# Altium schematic sheet USB-RS485.SchDoc: Название платы
size 420 x 297 mm; ApprovedBy: Рогов; CheckedBy: Фамилия проверяющего; DrawnBy: Нечаева А.Н.; DocumentNumber: Введите номер платы + Э3; SheetNumber: пусто если лист 1, иначе 1; SheetTotal: количество листов; Title1str: (при необходимости вторая строка); DocumentType: тип схемы; Format: A3; ImagePath: Введите номер платы
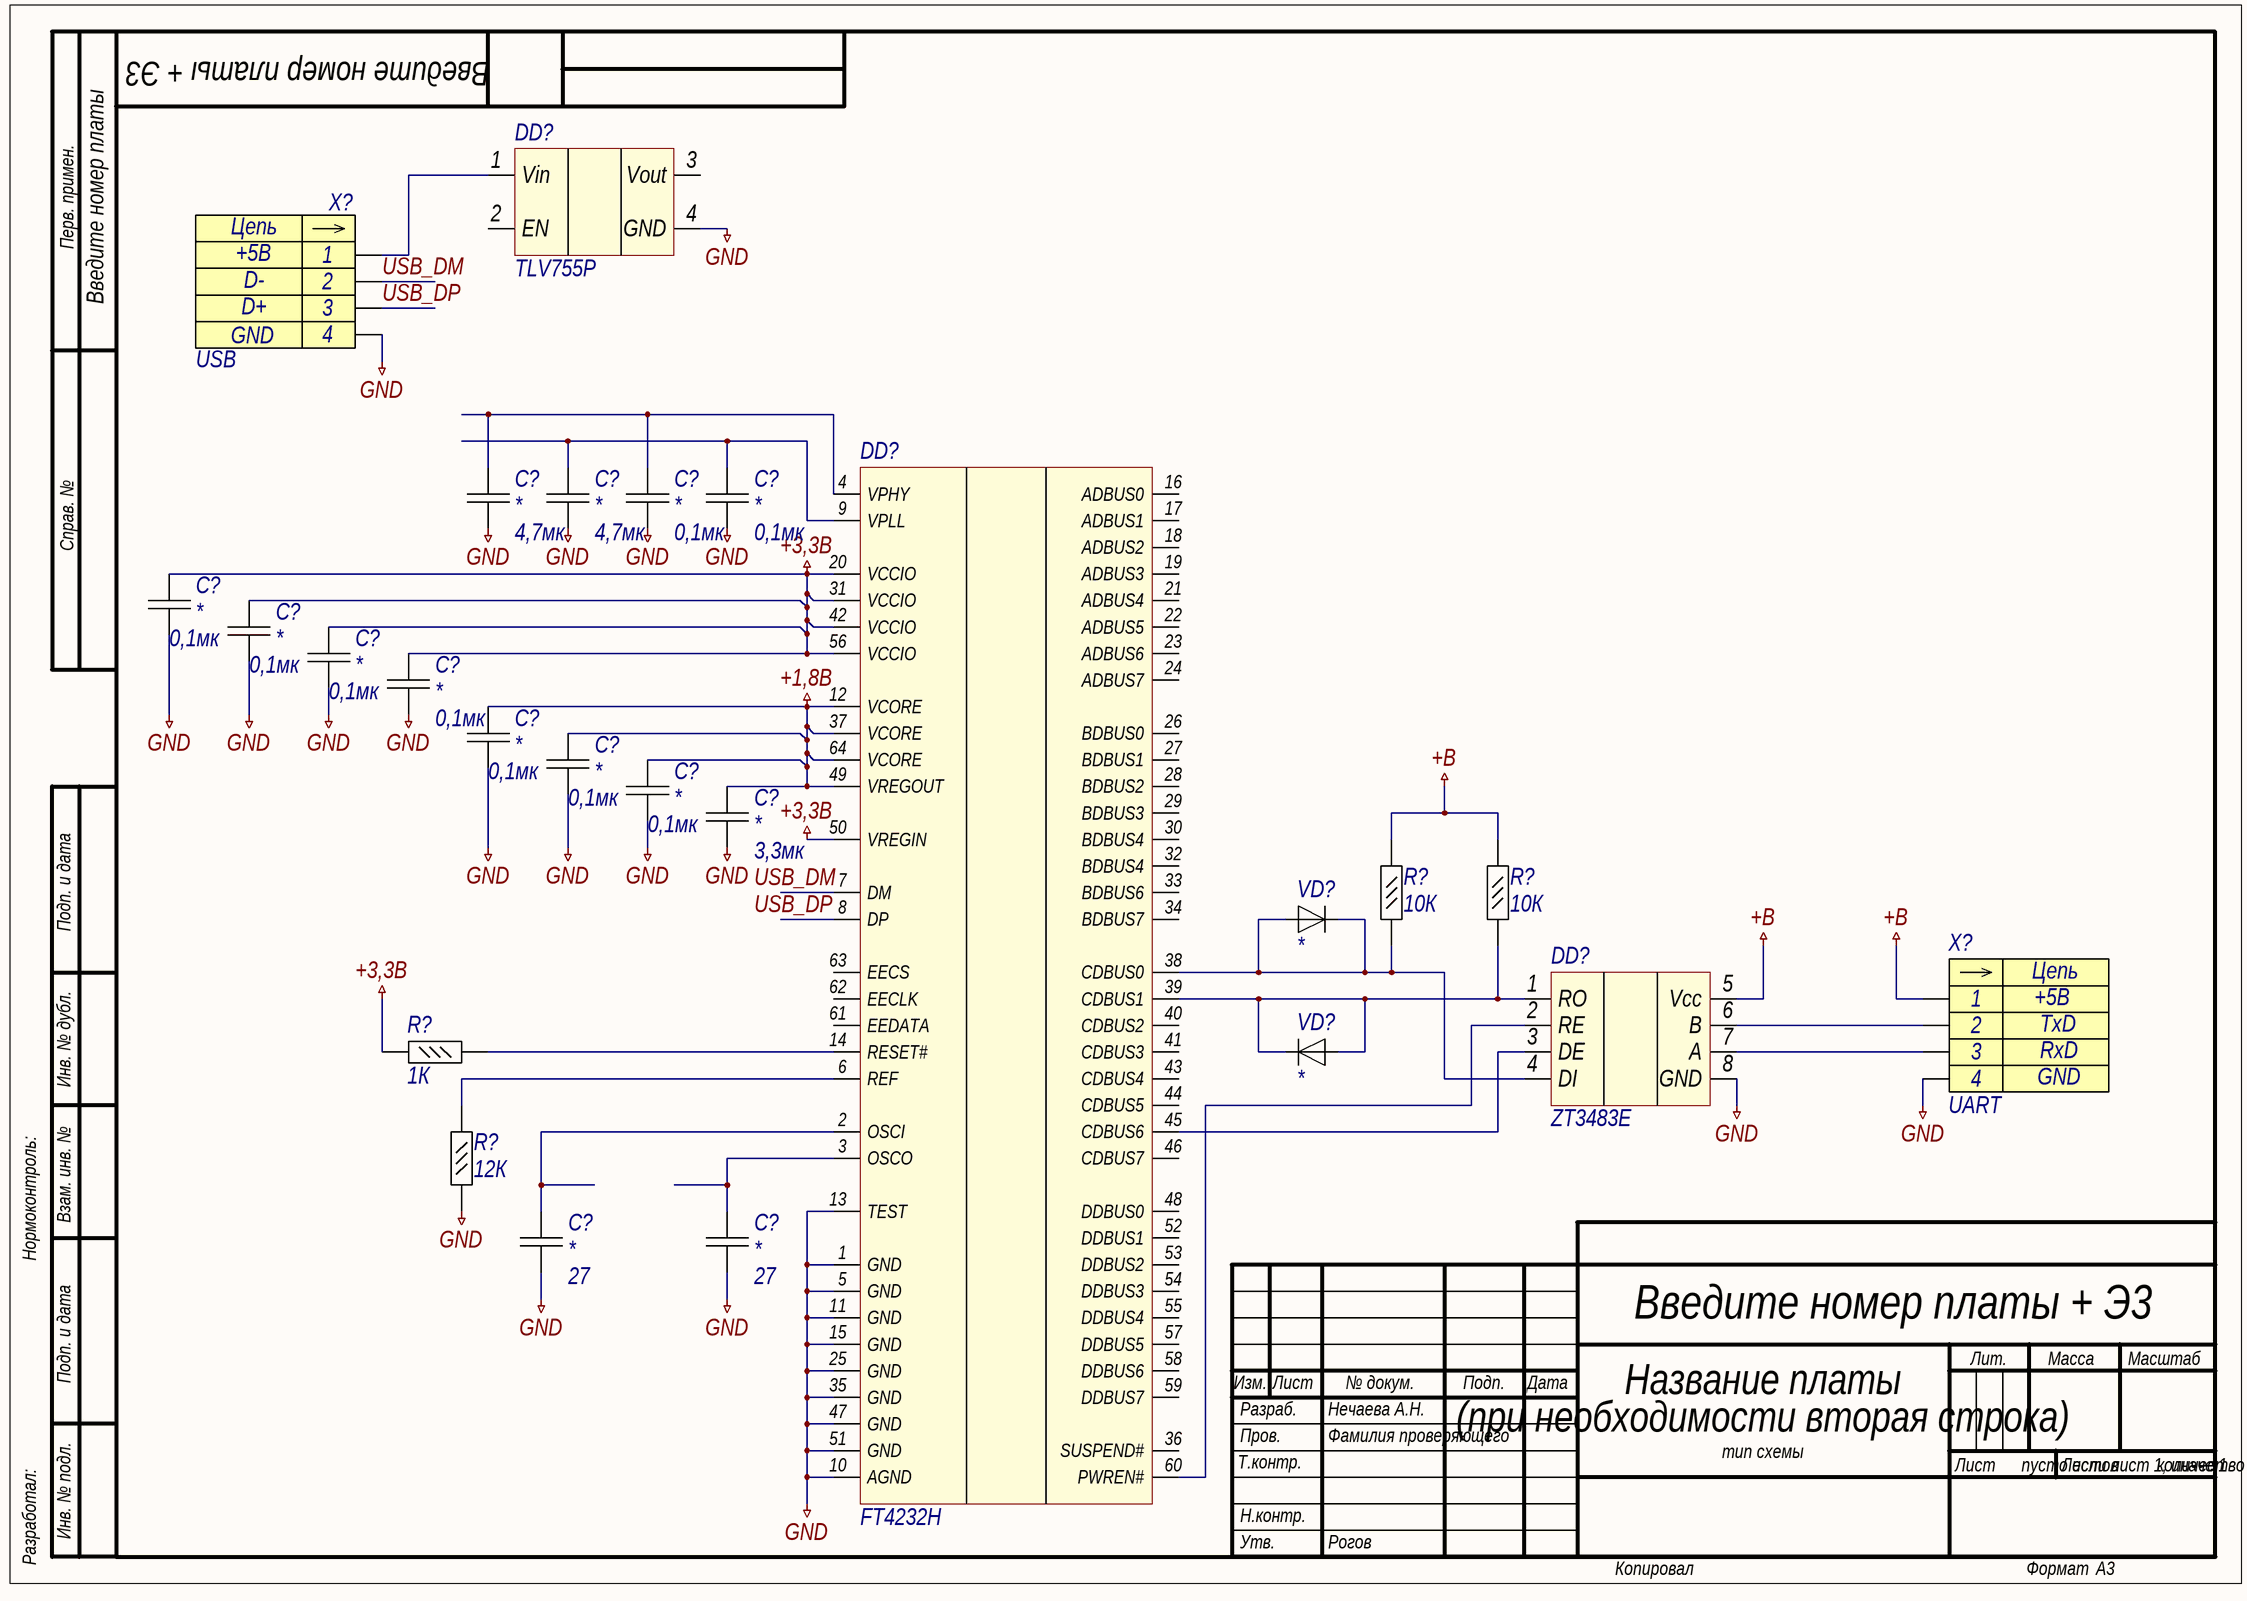
[diagram p0: USB-RS485.SchDoc]

## Parts
(Parts that share a designator on the sheet are numbered #1, #2 ... from top to bottom, then left to right.)
C?#1  Capacitance: 4,7мк  (hidden comment: Capacitor)
C?#2  Capacitance: 4,7мк  (hidden comment: Capacitor)
C?#3  Capacitance: 0,1мк  (hidden comment: Capacitor)
C?#4  Capacitance: 0,1мк  (hidden comment: Capacitor)
C?#5  Capacitance: 0,1мк  (hidden comment: Capacitor)
C?#6  Capacitance: 0,1мк  (hidden comment: Capacitor)
C?#7  Capacitance: 0,1мк  (hidden comment: Capacitor)
C?#8  Capacitance: 0,1мк  (hidden comment: Capacitor)
C?#9  Capacitance: 0,1мк  (hidden comment: Capacitor)
C?#10  Capacitance: 0,1мк  (hidden comment: Capacitor)
C?#11  Capacitance: 0,1мк  (hidden comment: Capacitor)
C?#12  Capacitance: 3,3мк  (hidden comment: Capacitor)
C?#13  Capacitance: 27  (hidden comment: Capacitor)
C?#14  Capacitance: 27  (hidden comment: Capacitor)
DD?#1  TLV755P
DD?#2  FT4232H
DD?#3  ZT3483E
R?#1  Impedance: 10К  (hidden comment: Res_0.05)
R?#2  Impedance: 10К  (hidden comment: Res_0.05)
R?#3  Impedance: 1К  (hidden comment: Res_0.05)
R?#4  Impedance: 12К  (hidden comment: Res_0.05)
VD?#1  *  [SOD123]
VD?#2  *  [SOD123]
X?#1  USB  U: +5В  Out: D-  In: D+  [USB]
X?#2  UART  In: TxD  Out: RxD  U: +5В  [UART]

## Nets
+1,8В: C?#9.11(C1+) C?#10.11(C1+) C?#11.11(C1+) C?#12.11(C1+) DD?#2.12(VCORE) DD?#2.37(VCORE) DD?#2.49(VREGOUT) DD?#2.64(VCORE)
+3,3В: C?#5.11(C1+) C?#6.11(C1+) C?#7.11(C1+) C?#8.11(C1+) DD?#2.20(VCCIO) DD?#2.31(VCCIO) DD?#2.42(VCCIO) DD?#2.50(VREGIN) DD?#2.56(VCCIO) R?#3.10(C1-)
+В: DD?#3.5(Vcc) R?#1.10(C1-) R?#2.10(C1-) X?#2.1
GND: C?#1.11(C1-) C?#2.11(C1-) C?#3.11(C1-) C?#4.11(C1-) C?#5.11(C1-) C?#6.11(C1-) C?#7.11(C1-) C?#8.11(C1-) C?#9.11(C1-) C?#10.11(C1-) C?#11.11(C1-) C?#12.11(C1-) C?#13.11(C1-) C?#14.11(C1-) DD?#1.4(GND) DD?#2.1(GND) DD?#2.5(GND) DD?#2.10(AGND) DD?#2.11(GND) DD?#2.13(TEST) DD?#2.15(GND) DD?#2.25(GND) DD?#2.35(GND) DD?#2.47(GND) DD?#2.51(GND) DD?#3.8(GND) R?#4.9(C1-) X?#1.4 X?#2.4
USB_DM: X?#1.2
USB_DP: X?#1.3
NetC?#1_11: C?#1.11(C1+) C?#3.11(C1+) DD?#2.4(VPHY)
NetC?#2_11: C?#2.11(C1+) C?#4.11(C1+) DD?#2.9(VPLL)
NetC?#13_11: C?#13.11(C1+) DD?#2.2(OSCI)
NetC?#14_11: C?#14.11(C1+) DD?#2.3(OSCO)
NetDD?#1_1: DD?#1.1(Vin) X?#1.1
NetDD?#2_6: DD?#2.6(REF) R?#4.10(C1-)
NetDD?#2_14: DD?#2.14(RESET#) R?#3.9(C1-)
NetDD?#2_38: DD?#2.38(CDBUS0) DD?#3.4(DI) R?#1.9(C1-) VD?#1.1 VD?#1.2
NetDD?#2_39: DD?#2.39(CDBUS1) DD?#3.1(RO) R?#2.9(C1-) VD?#2.1 VD?#2.2
NetDD?#2_45: DD?#2.45(CDBUS6) DD?#3.3(DE)
NetDD?#2_60: DD?#2.60(PWREN#) DD?#3.2(RE)
NetDD?#3_6: DD?#3.6(B) X?#2.2
NetDD?#3_7: DD?#3.7(A) X?#2.3

Not connected (* = marked no-connect by the designer): DD?#1 2(EN) 3(Vout); DD?#2 7(DM) 8(DP) 16(ADBUS0) 17(ADBUS1) 18(ADBUS2) 19(ADBUS3) 21(ADBUS4) 22(ADBUS5) 23(ADBUS6) 24(ADBUS7) 26(BDBUS0) 27(BDBUS1) 28(BDBUS2) 29(BDBUS3) 30(BDBUS4) 32(BDBUS4) 33(BDBUS6) 34(BDBUS7) 36(SUSPEND#) 40(CDBUS2) 41(CDBUS3) 43(CDBUS4) 44(CDBUS5) 46(CDBUS7) 48(DDBUS0) 52(DDBUS1) 53(DDBUS2) 54(DDBUS3) 55(DDBUS4) 57(DDBUS5) 58(DDBUS6) 59(DDBUS7) 61(EEDATA) 62(EECLK) 63(EECS)

## Notes on the sheet
- Перв. примен.
- Справ. №
- Подп. и дата
- Инв. № дубл.
- Нормоконтроль:
- Взам. инв. №
- Изм.
- Лист
- № докум.
- Подп.
- Дата
- Лит.
- Масса
- Масштаб
- Т.контр.
- Пров.
- Разраб.
- Листов
- Разработал:
- Инв. № подл.
- Н.контр.
- Утв.
- Копировал
- Формат
- Labels drawn without touching a wire or pin: USB_DM, USB_DP
- (in symbol UART) Цепь
- (in symbol USB) Цепь

## Library data of the parts
DD?#1 = LDO +3.3V: Case: *; HelpUrL: https://ru.mouser.com/ProductDetail/Texas-Instruments/TLV75533PDBVR?qs=sGAEpiMZZMsGz1a6aV8DcD1rpA6FsR3JKgt9d%252bpuSX4%3d; Model: TLV755P
DD?#2 = DS_FT4232H: Manufactere: FTDI, Future Technology Devices International Ltd; HelpURL: https://www.ftdichip.com/Products/ICs/FT4232H.htm; Case: QFN-64; Model: FT4232H
VD?#1 VD?#2 = Diod: ComponentKind: *; Manufacturer: *; Model: *; HelpURL: *
X?#1 = USB: Create: DeathSpeaker; GND: GND
X?#2 = UART: Create: DeathSpeaker; GND: GND
C?#1-C?#14 = Capacitor: Manufacture: *; Case: *; HelpURL: *; Model: *; Voltage: *
DD?#3 = ZT3483E: Case: nSOIC-8; Model: ZT3483E; Manufacture: *; HelpURL: *
R?#1-R?#4 = Res_0.05: Case: *; Manufacture: *; HelpURL: *; Model: *